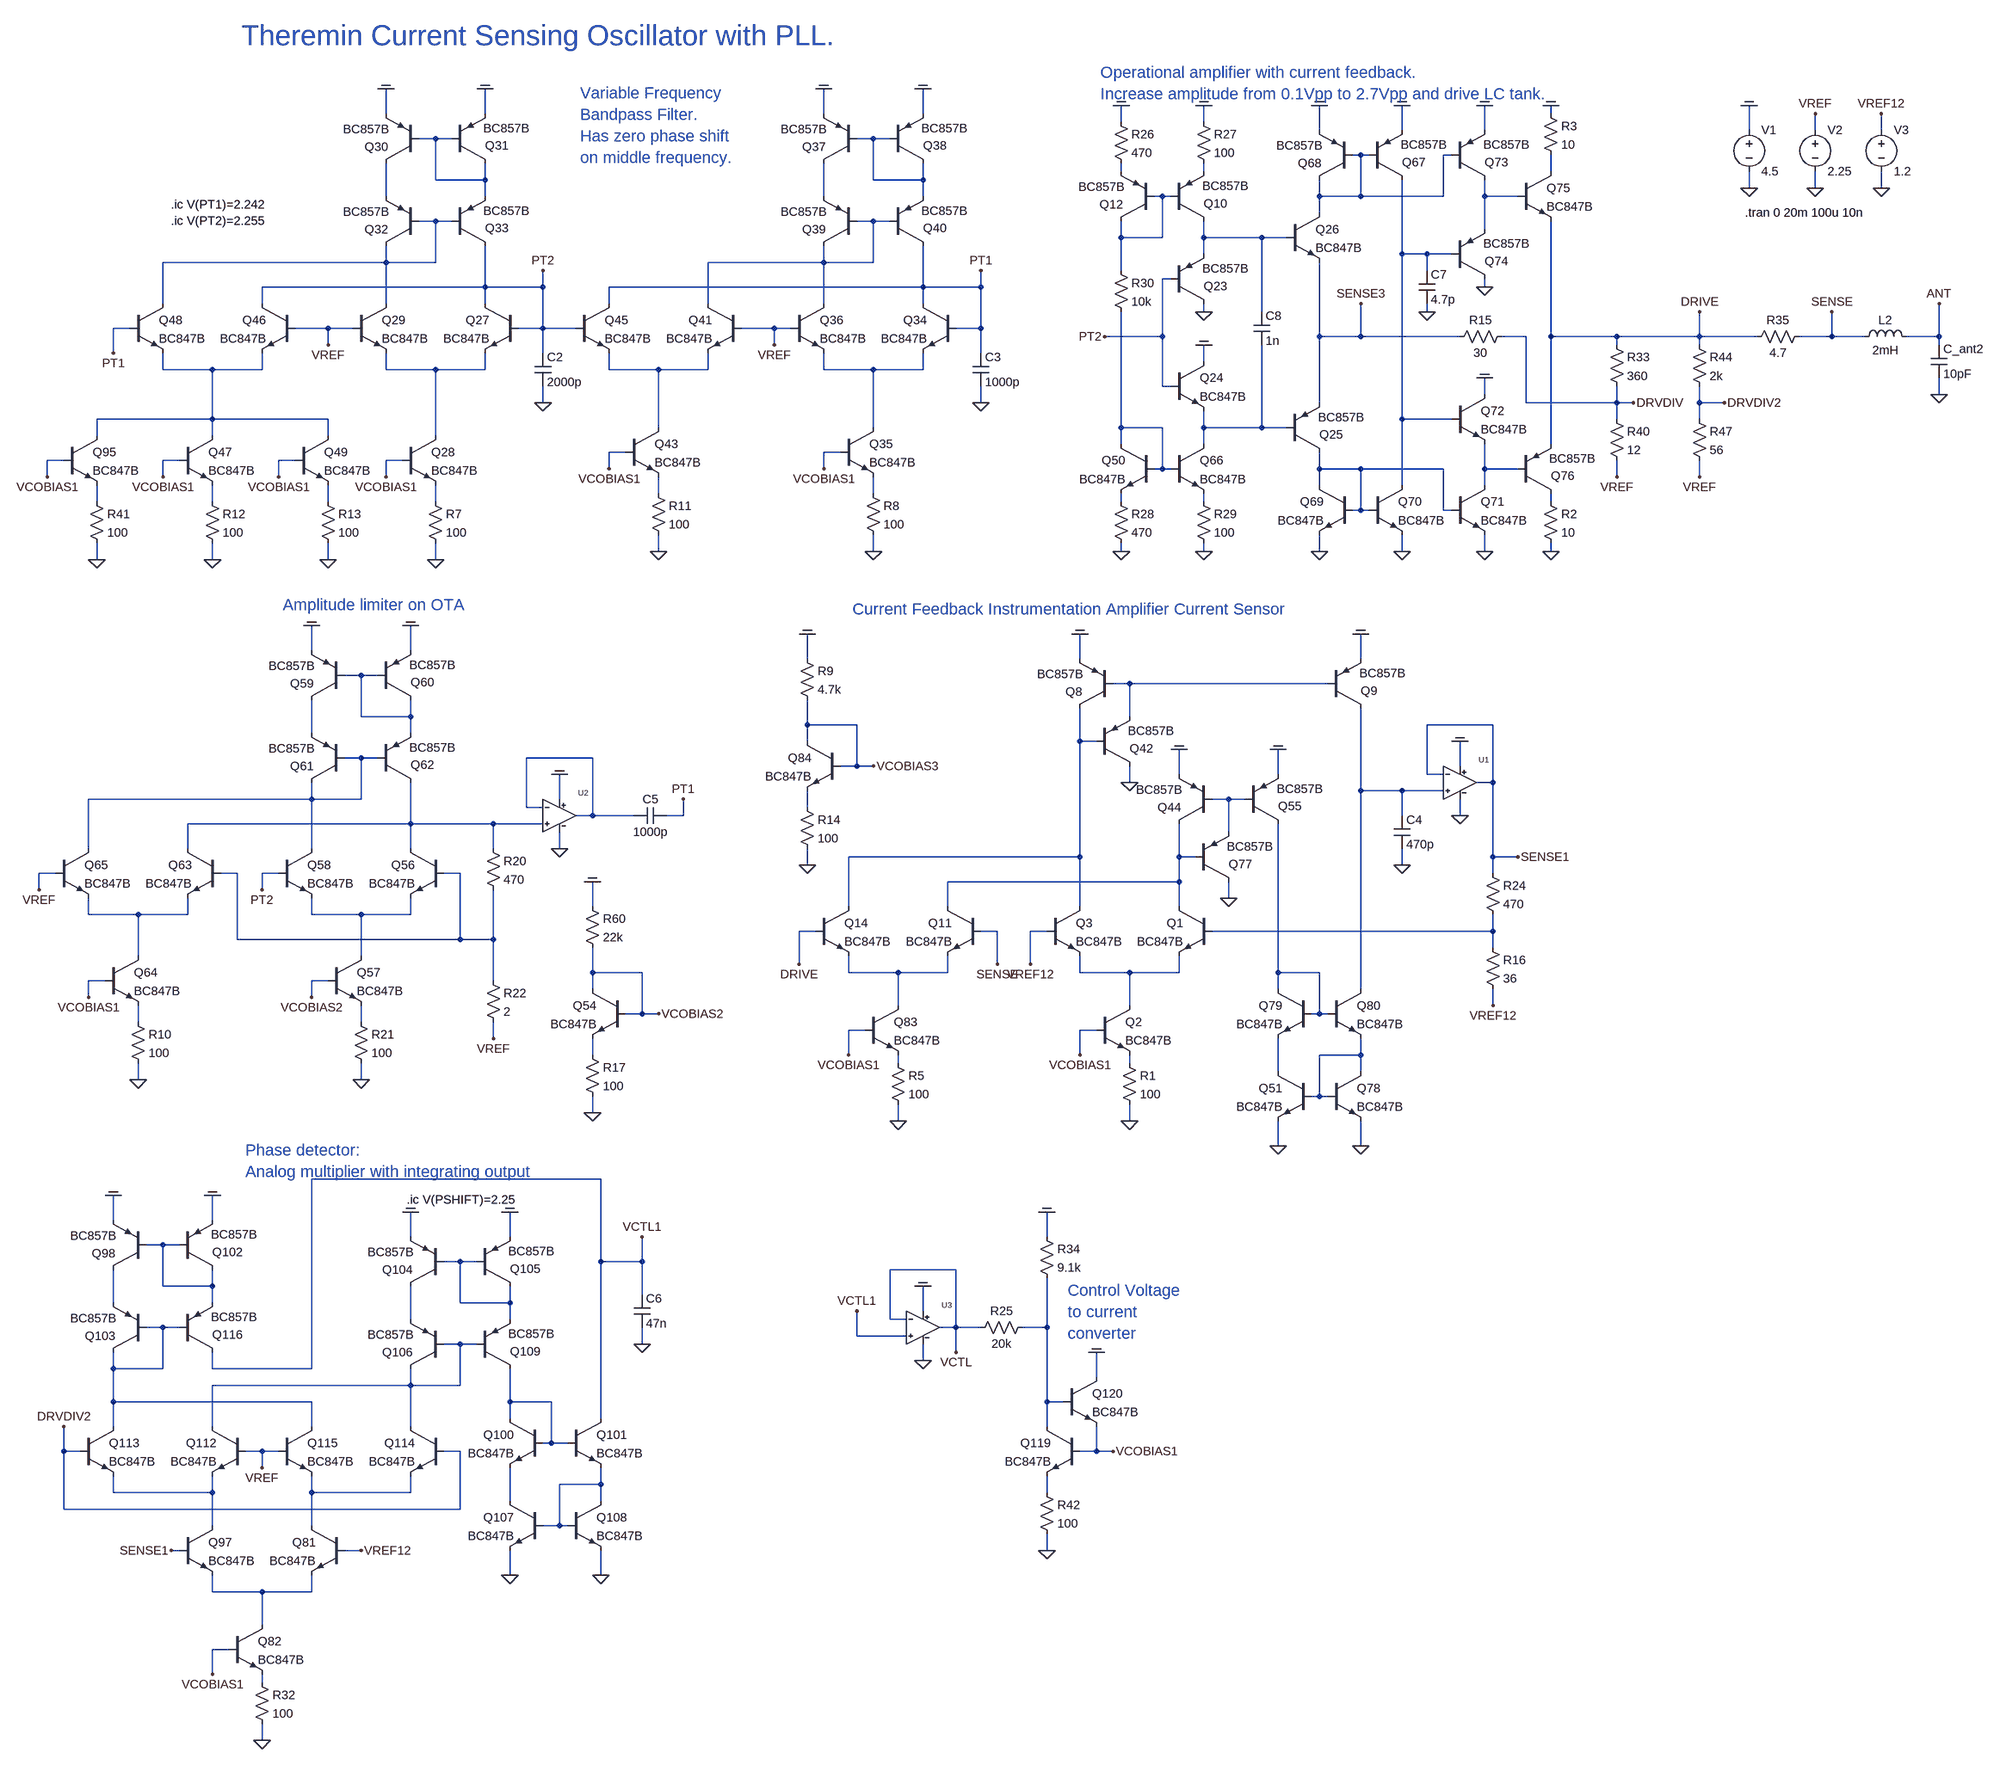
[diagram p0: schematic vco_and_lc_drive_v03.asc]
vco_and_lc_drive_v03.asc, the LTspice schematic file:
Version 4
SHEET 1 13504 21184
WIRE -5552 15856 -5552 15808
WIRE -5360 15856 -5360 15808
WIRE -4704 15856 -4704 15808
WIRE -4512 15856 -4512 15808
WIRE -3296 15856 -3296 15840
WIRE -4128 15872 -4128 15840
WIRE -3968 15872 -3968 15840
WIRE -3744 15888 -3744 15840
WIRE -3584 15888 -3584 15840
WIRE -3424 15888 -3424 15840
WIRE -2912 15888 -2912 15840
WIRE -2784 15888 -2784 15856
WIRE -2656 15888 -2656 15856
WIRE -5456 15904 -5488 15904
WIRE -5424 15904 -5456 15904
WIRE -4608 15904 -4640 15904
WIRE -4576 15904 -4608 15904
WIRE -3664 15936 -3680 15936
WIRE -3648 15936 -3664 15936
WIRE -3488 15936 -3504 15936
WIRE -4128 15968 -4128 15952
WIRE -3968 15968 -3968 15952
WIRE -3296 15968 -3296 15936
WIRE -5456 15984 -5456 15904
WIRE -5360 15984 -5360 15952
WIRE -5360 15984 -5456 15984
WIRE -4608 15984 -4608 15904
WIRE -4512 15984 -4512 15952
WIRE -4512 15984 -4608 15984
WIRE -2912 16000 -2912 15968
WIRE -2784 16000 -2784 15968
WIRE -2656 16000 -2656 15968
WIRE -5552 16016 -5552 15952
WIRE -5360 16016 -5360 15984
WIRE -4704 16016 -4704 15952
WIRE -4512 16016 -4512 15984
WIRE -4048 16016 -4064 16016
WIRE -4032 16016 -4048 16016
WIRE -3744 16016 -3744 15984
WIRE -3664 16016 -3664 15936
WIRE -3664 16016 -3744 16016
WIRE -3504 16016 -3504 15936
WIRE -3504 16016 -3664 16016
WIRE -3424 16016 -3424 15984
WIRE -3360 16016 -3424 16016
WIRE -3744 16048 -3744 16016
WIRE -5456 16064 -5488 16064
WIRE -5424 16064 -5456 16064
WIRE -4608 16064 -4640 16064
WIRE -4576 16064 -4608 16064
WIRE -3424 16080 -3424 16016
WIRE -4128 16096 -4128 16064
WIRE -4048 16096 -4048 16016
WIRE -4048 16096 -4128 16096
WIRE -3968 16096 -3968 16064
WIRE -3856 16096 -3968 16096
WIRE -3808 16096 -3856 16096
WIRE -3968 16128 -3968 16096
WIRE -3584 16128 -3584 15984
WIRE -3536 16128 -3584 16128
WIRE -3488 16128 -3536 16128
WIRE -5552 16144 -5552 16112
WIRE -5552 16144 -5984 16144
WIRE -5456 16144 -5456 16064
WIRE -5456 16144 -5552 16144
WIRE -4704 16144 -4704 16112
WIRE -4704 16144 -4928 16144
WIRE -4608 16144 -4608 16064
WIRE -4608 16144 -4704 16144
WIRE -4128 16160 -4128 16096
WIRE -3536 16160 -3536 16128
WIRE -4032 16176 -4048 16176
WIRE -5360 16192 -5360 16112
WIRE -5360 16192 -5792 16192
WIRE -5248 16192 -5248 16160
WIRE -5248 16192 -5360 16192
WIRE -4512 16192 -4512 16112
WIRE -4512 16192 -5120 16192
WIRE -4400 16192 -4400 16160
WIRE -4400 16192 -4512 16192
WIRE -3424 16192 -3424 16176
WIRE -5984 16224 -5984 16144
WIRE -5792 16224 -5792 16192
WIRE -5552 16224 -5552 16144
WIRE -5360 16224 -5360 16192
WIRE -5120 16224 -5120 16192
WIRE -4928 16224 -4928 16144
WIRE -4704 16224 -4704 16144
WIRE -4512 16224 -4512 16192
WIRE -3968 16240 -3968 16224
WIRE -3856 16240 -3856 16096
WIRE -3536 16240 -3536 16224
WIRE -6048 16272 -6080 16272
WIRE -5664 16272 -5728 16272
WIRE -5616 16272 -5664 16272
WIRE -5248 16272 -5248 16192
WIRE -5248 16272 -5296 16272
WIRE -5184 16272 -5248 16272
WIRE -4800 16272 -4864 16272
WIRE -4768 16272 -4800 16272
WIRE -4400 16272 -4400 16192
WIRE -4400 16272 -4448 16272
WIRE -4048 16288 -4048 16176
WIRE -4048 16288 -4160 16288
WIRE -3744 16288 -3744 16144
WIRE -3664 16288 -3664 16224
WIRE -3664 16288 -3744 16288
WIRE -3472 16288 -3664 16288
WIRE -3344 16288 -3392 16288
WIRE -3296 16288 -3296 16064
WIRE -3168 16288 -3296 16288
WIRE -3008 16288 -3008 16240
WIRE -3008 16288 -3168 16288
WIRE -2896 16288 -3008 16288
WIRE -2752 16288 -2752 16240
WIRE -2752 16288 -2816 16288
WIRE -2688 16288 -2752 16288
WIRE -2544 16288 -2544 16224
WIRE -2544 16288 -2608 16288
WIRE -5664 16304 -5664 16272
WIRE -4800 16304 -4800 16272
WIRE -3168 16304 -3168 16288
WIRE -3008 16304 -3008 16288
WIRE -2544 16304 -2544 16288
WIRE -6080 16320 -6080 16272
WIRE -5248 16320 -5248 16272
WIRE -4400 16320 -4400 16272
WIRE -3968 16336 -3968 16304
WIRE -5984 16352 -5984 16320
WIRE -5888 16352 -5984 16352
WIRE -5792 16352 -5792 16320
WIRE -5792 16352 -5888 16352
WIRE -5552 16352 -5552 16320
WIRE -5456 16352 -5552 16352
WIRE -5360 16352 -5360 16320
WIRE -5360 16352 -5456 16352
WIRE -5120 16352 -5120 16320
WIRE -5024 16352 -5120 16352
WIRE -4928 16352 -4928 16320
WIRE -4928 16352 -5024 16352
WIRE -4704 16352 -4704 16320
WIRE -4608 16352 -4704 16352
WIRE -4512 16352 -4512 16320
WIRE -4512 16352 -4608 16352
WIRE -4048 16384 -4048 16288
WIRE -4032 16384 -4048 16384
WIRE -3424 16400 -3424 16368
WIRE -2544 16400 -2544 16368
WIRE -5248 16416 -5248 16384
WIRE -4400 16416 -4400 16384
WIRE -3744 16416 -3744 16288
WIRE -3344 16416 -3344 16288
WIRE -3168 16416 -3168 16384
WIRE -3168 16416 -3344 16416
WIRE -3136 16416 -3168 16416
WIRE -3008 16416 -3008 16384
WIRE -2960 16416 -3008 16416
WIRE -5888 16448 -5888 16352
WIRE -5888 16448 -6112 16448
WIRE -5664 16448 -5888 16448
WIRE -3584 16448 -3584 16128
WIRE -3488 16448 -3584 16448
WIRE -3168 16448 -3168 16416
WIRE -3008 16448 -3008 16416
WIRE -5024 16464 -5024 16352
WIRE -4608 16464 -4608 16352
WIRE -4128 16464 -4128 16240
WIRE -4048 16464 -4128 16464
WIRE -3968 16464 -3968 16432
WIRE -3856 16464 -3856 16304
WIRE -3856 16464 -3968 16464
WIRE -3808 16464 -3856 16464
WIRE -6112 16480 -6112 16448
WIRE -5888 16480 -5888 16448
WIRE -5664 16480 -5664 16448
WIRE -5456 16480 -5456 16352
WIRE -4128 16496 -4128 16464
WIRE -3968 16496 -3968 16464
WIRE -3296 16496 -3296 16288
WIRE -5088 16512 -5120 16512
WIRE -4672 16512 -4704 16512
WIRE -6176 16528 -6208 16528
WIRE -5952 16528 -5984 16528
WIRE -5728 16528 -5760 16528
WIRE -5520 16528 -5552 16528
WIRE -5120 16544 -5120 16512
WIRE -4704 16544 -4704 16512
WIRE -4048 16544 -4048 16464
WIRE -4048 16544 -4064 16544
WIRE -4032 16544 -4048 16544
WIRE -3744 16544 -3744 16512
WIRE -3664 16544 -3744 16544
WIRE -3504 16544 -3664 16544
WIRE -3424 16544 -3424 16496
WIRE -3360 16544 -3424 16544
WIRE -6208 16560 -6208 16528
WIRE -5984 16560 -5984 16528
WIRE -5760 16560 -5760 16528
WIRE -5552 16560 -5552 16528
WIRE -3168 16560 -3168 16528
WIRE -3008 16560 -3008 16528
WIRE -3744 16576 -3744 16544
WIRE -3584 16576 -3584 16448
WIRE -3424 16576 -3424 16544
WIRE -5024 16592 -5024 16560
WIRE -4608 16592 -4608 16560
WIRE -6112 16608 -6112 16576
WIRE -5888 16608 -5888 16576
WIRE -5664 16608 -5664 16576
WIRE -5456 16608 -5456 16576
WIRE -4128 16608 -4128 16592
WIRE -3968 16608 -3968 16592
WIRE -3296 16608 -3296 16592
WIRE -3664 16624 -3664 16544
WIRE -3664 16624 -3680 16624
WIRE -3648 16624 -3664 16624
WIRE -3504 16624 -3504 16544
WIRE -3488 16624 -3504 16624
WIRE -5024 16704 -5024 16672
WIRE -4608 16704 -4608 16672
WIRE -4128 16704 -4128 16688
WIRE -3968 16704 -3968 16688
WIRE -3744 16704 -3744 16672
WIRE -3584 16704 -3584 16672
WIRE -3424 16704 -3424 16672
WIRE -3296 16704 -3296 16688
WIRE -6112 16720 -6112 16688
WIRE -5888 16720 -5888 16688
WIRE -5664 16720 -5664 16688
WIRE -5456 16720 -5456 16688
WIRE -5696 16896 -5696 16848
WIRE -5504 16896 -5504 16848
WIRE -4736 16912 -4736 16864
WIRE -4208 16912 -4208 16864
WIRE -3664 16912 -3664 16864
WIRE -5600 16944 -5632 16944
WIRE -5568 16944 -5600 16944
WIRE -4112 16960 -4144 16960
WIRE -3728 16960 -4112 16960
WIRE -5600 17024 -5600 16944
WIRE -5504 17024 -5504 16992
WIRE -5504 17024 -5600 17024
WIRE -4112 17024 -4112 16960
WIRE -4736 17040 -4736 16992
WIRE -4640 17040 -4736 17040
WIRE -3408 17040 -3536 17040
WIRE -5696 17056 -5696 16992
WIRE -5504 17056 -5504 17024
WIRE -4736 17072 -4736 17040
WIRE -4208 17072 -4208 17008
WIRE -4176 17072 -4208 17072
WIRE -5600 17104 -5632 17104
WIRE -5568 17104 -5600 17104
WIRE -5152 17104 -5280 17104
WIRE -4640 17120 -4640 17040
WIRE -4640 17120 -4672 17120
WIRE -4608 17120 -4640 17120
WIRE -3472 17120 -3472 17072
WIRE -4016 17136 -4016 17088
WIRE -3824 17136 -3824 17088
WIRE -3536 17136 -3536 17040
WIRE -3504 17136 -3536 17136
WIRE -4112 17152 -4112 17120
WIRE -3408 17152 -3408 17040
WIRE -3408 17152 -3440 17152
WIRE -3664 17168 -3664 17008
WIRE -3584 17168 -3664 17168
WIRE -3504 17168 -3584 17168
WIRE -5696 17184 -5696 17152
WIRE -5696 17184 -6128 17184
WIRE -5600 17184 -5600 17104
WIRE -5600 17184 -5696 17184
WIRE -5216 17184 -5216 17136
WIRE -3920 17184 -3952 17184
WIRE -3888 17184 -3920 17184
WIRE -5280 17200 -5280 17104
WIRE -5248 17200 -5280 17200
WIRE -4736 17200 -4736 17168
WIRE -5152 17216 -5152 17104
WIRE -5152 17216 -5184 17216
WIRE -5072 17216 -5152 17216
WIRE -4976 17216 -4976 17184
WIRE -4976 17216 -5008 17216
WIRE -3584 17216 -3584 17168
WIRE -3472 17216 -3472 17184
WIRE -5504 17232 -5504 17152
WIRE -5504 17232 -5936 17232
WIRE -5344 17232 -5504 17232
WIRE -5248 17232 -5344 17232
WIRE -3920 17248 -3920 17184
WIRE -6128 17280 -6128 17184
WIRE -5936 17280 -5936 17232
WIRE -5696 17280 -5696 17184
WIRE -5504 17280 -5504 17232
WIRE -5344 17280 -5344 17232
WIRE -5216 17280 -5216 17248
WIRE -4208 17296 -4208 17072
WIRE -4208 17296 -4656 17296
WIRE -4016 17296 -4016 17232
WIRE -3984 17296 -4016 17296
WIRE -3408 17296 -3408 17152
WIRE -3360 17296 -3408 17296
WIRE -4736 17312 -4736 17280
WIRE -3584 17312 -3584 17280
WIRE -6192 17328 -6224 17328
WIRE -5840 17328 -5872 17328
WIRE -5760 17328 -5792 17328
WIRE -5408 17328 -5440 17328
WIRE -3408 17328 -3408 17296
WIRE -4016 17344 -4016 17296
WIRE -4016 17344 -4464 17344
WIRE -6224 17360 -6224 17328
WIRE -5792 17360 -5792 17328
WIRE -3920 17376 -3920 17344
WIRE -5152 17392 -5152 17344
WIRE -4656 17392 -4656 17296
WIRE -4464 17392 -4464 17344
WIRE -4208 17392 -4208 17296
WIRE -4016 17392 -4016 17344
WIRE -6128 17408 -6128 17376
WIRE -6032 17408 -6128 17408
WIRE -5936 17408 -5936 17376
WIRE -5936 17408 -6032 17408
WIRE -5696 17408 -5696 17376
WIRE -5600 17408 -5696 17408
WIRE -5504 17408 -5504 17376
WIRE -5504 17408 -5600 17408
WIRE -4720 17440 -4752 17440
WIRE -4368 17440 -4400 17440
WIRE -4272 17440 -4304 17440
WIRE -3408 17440 -3408 17408
WIRE -3408 17440 -3952 17440
WIRE -5840 17456 -5840 17328
WIRE -5408 17456 -5408 17328
WIRE -5408 17456 -5840 17456
WIRE -5344 17456 -5344 17360
WIRE -5344 17456 -5408 17456
WIRE -3408 17472 -3408 17440
WIRE -6032 17488 -6032 17408
WIRE -5600 17488 -5600 17408
WIRE -4752 17504 -4752 17440
WIRE -4368 17504 -4368 17440
WIRE -4304 17504 -4304 17440
WIRE -5152 17520 -5152 17472
WIRE -5056 17520 -5152 17520
WIRE -4656 17520 -4656 17488
WIRE -4560 17520 -4656 17520
WIRE -4464 17520 -4464 17488
WIRE -4464 17520 -4560 17520
WIRE -4208 17520 -4208 17488
WIRE -4112 17520 -4208 17520
WIRE -4016 17520 -4016 17488
WIRE -4016 17520 -4112 17520
WIRE -3824 17520 -3824 17232
WIRE -3744 17520 -3824 17520
WIRE -6096 17536 -6128 17536
WIRE -5664 17536 -5696 17536
WIRE -5344 17536 -5344 17456
WIRE -5152 17552 -5152 17520
WIRE -3824 17552 -3824 17520
WIRE -3664 17552 -3664 17168
WIRE -6128 17568 -6128 17536
WIRE -5696 17568 -5696 17536
WIRE -4560 17584 -4560 17520
WIRE -4112 17584 -4112 17520
WIRE -3408 17584 -3408 17552
WIRE -5056 17600 -5056 17520
WIRE -5056 17600 -5088 17600
WIRE -5024 17600 -5056 17600
WIRE -3744 17600 -3744 17520
WIRE -3744 17600 -3760 17600
WIRE -3728 17600 -3744 17600
WIRE -6032 17616 -6032 17584
WIRE -5600 17616 -5600 17584
WIRE -4624 17632 -4656 17632
WIRE -4176 17632 -4208 17632
WIRE -5344 17648 -5344 17616
WIRE -5152 17680 -5152 17648
WIRE -4656 17680 -4656 17632
WIRE -4208 17680 -4208 17632
WIRE -3664 17680 -3664 17648
WIRE -3664 17680 -3744 17680
WIRE -4560 17696 -4560 17680
WIRE -4112 17696 -4112 17680
WIRE -3824 17712 -3824 17648
WIRE -3664 17712 -3664 17680
WIRE -6032 17728 -6032 17696
WIRE -5600 17728 -5600 17696
WIRE -3744 17760 -3744 17680
WIRE -3744 17760 -3760 17760
WIRE -3728 17760 -3744 17760
WIRE -5152 17792 -5152 17760
WIRE -4560 17808 -4560 17776
WIRE -4112 17808 -4112 17776
WIRE -3824 17856 -3824 17808
WIRE -3664 17856 -3664 17808
WIRE -5136 17920 -5696 17920
WIRE -6080 18000 -6080 17952
WIRE -5888 18000 -5888 17952
WIRE -5504 18032 -5504 17984
WIRE -5312 18032 -5312 17984
WIRE -4272 18032 -4272 17984
WIRE -5984 18048 -6016 18048
WIRE -5952 18048 -5984 18048
WIRE -5408 18080 -5440 18080
WIRE -5376 18080 -5408 18080
WIRE -5136 18080 -5136 17920
WIRE -5056 18080 -5056 18032
WIRE -5056 18080 -5136 18080
WIRE -4448 18096 -4576 18096
WIRE -5984 18128 -5984 18048
WIRE -5888 18128 -5888 18096
WIRE -5888 18128 -5984 18128
WIRE -5056 18144 -5056 18080
WIRE -6080 18160 -6080 18096
WIRE -5888 18160 -5888 18128
WIRE -5408 18160 -5408 18080
WIRE -5312 18160 -5312 18128
WIRE -5312 18160 -5408 18160
WIRE -4512 18176 -4512 18128
WIRE -5504 18192 -5504 18128
WIRE -5312 18192 -5312 18160
WIRE -4576 18192 -4576 18096
WIRE -4544 18192 -4576 18192
WIRE -5984 18208 -6016 18208
WIRE -5952 18208 -5984 18208
WIRE -4448 18208 -4448 18096
WIRE -4448 18208 -4480 18208
WIRE -4400 18208 -4448 18208
WIRE -4272 18208 -4272 18112
WIRE -4272 18208 -4320 18208
WIRE -4640 18224 -4640 18176
WIRE -4544 18224 -4640 18224
WIRE -5408 18240 -5440 18240
WIRE -5376 18240 -5408 18240
WIRE -5056 18240 -5056 18208
WIRE -4448 18256 -4448 18208
WIRE -4512 18272 -4512 18240
WIRE -6080 18288 -6080 18256
WIRE -5984 18288 -5984 18208
WIRE -5984 18288 -6080 18288
WIRE -5888 18288 -5888 18256
WIRE -5696 18288 -5696 17920
WIRE -5696 18288 -5888 18288
WIRE -4176 18304 -4176 18256
WIRE -5504 18320 -5504 18288
WIRE -5504 18320 -5888 18320
WIRE -5408 18320 -5408 18240
WIRE -5408 18320 -5504 18320
WIRE -6080 18352 -6080 18288
WIRE -5696 18352 -6080 18352
WIRE -5312 18352 -5312 18288
WIRE -5232 18352 -5312 18352
WIRE -4272 18352 -4272 18208
WIRE -4240 18352 -4272 18352
WIRE -5312 18384 -5312 18352
WIRE -5136 18384 -5136 18080
WIRE -6080 18400 -6080 18352
WIRE -5888 18400 -5888 18320
WIRE -5696 18400 -5696 18352
WIRE -5504 18400 -5504 18320
WIRE -4272 18400 -4272 18352
WIRE -5232 18432 -5232 18352
WIRE -5232 18432 -5248 18432
WIRE -5200 18432 -5232 18432
WIRE -6176 18448 -6176 18400
WIRE -6144 18448 -6176 18448
WIRE -5792 18448 -5824 18448
WIRE -5760 18448 -5792 18448
WIRE -5408 18448 -5440 18448
WIRE -4176 18448 -4176 18400
WIRE -4176 18448 -4208 18448
WIRE -4144 18448 -4176 18448
WIRE -5792 18480 -5792 18448
WIRE -5136 18512 -5136 18480
WIRE -5136 18512 -5216 18512
WIRE -6080 18528 -6080 18496
WIRE -5888 18528 -5888 18496
WIRE -5888 18528 -6080 18528
WIRE -5696 18528 -5696 18496
WIRE -5504 18528 -5504 18496
WIRE -5504 18528 -5696 18528
WIRE -4272 18528 -4272 18496
WIRE -5312 18544 -5312 18480
WIRE -5136 18544 -5136 18512
WIRE -6176 18560 -6176 18448
WIRE -5408 18560 -5408 18448
WIRE -5408 18560 -6176 18560
WIRE -5888 18592 -5888 18528
WIRE -5696 18592 -5696 18528
WIRE -5216 18592 -5216 18512
WIRE -5216 18592 -5248 18592
WIRE -5200 18592 -5216 18592
WIRE -5952 18640 -5968 18640
WIRE -5600 18640 -5632 18640
WIRE -4272 18640 -4272 18608
WIRE -5312 18688 -5312 18640
WIRE -5136 18688 -5136 18640
WIRE -5888 18720 -5888 18688
WIRE -5792 18720 -5888 18720
WIRE -5696 18720 -5696 18688
WIRE -5696 18720 -5792 18720
WIRE -5792 18784 -5792 18720
WIRE -5856 18832 -5888 18832
WIRE -5888 18880 -5888 18832
WIRE -5792 18896 -5792 18880
WIRE -5792 19008 -5792 18976
FLAG -2912 16000 0
FLAG -2912 15840 COM
FLAG -2784 16000 0
FLAG -2784 15856 VREF
FLAG -5152 17344 COM
FLAG -5024 17600 VCOBIAS2
FLAG -5152 17792 0
FLAG -5552 16560 VCOBIAS1
FLAG -5456 16720 0
FLAG -5552 15808 COM
FLAG -5360 15808 COM
FLAG -4704 16544 VCOBIAS1
FLAG -4400 16416 0
FLAG -4704 15808 COM
FLAG -4512 15808 COM
FLAG -5120 16544 VCOBIAS1
FLAG -5024 16704 0
FLAG -4800 16304 VREF
FLAG -5984 16560 VCOBIAS1
FLAG -5888 16720 0
FLAG -5664 16304 VREF
FLAG -5696 17568 VCOBIAS2
FLAG -5344 17648 VREF
FLAG -5600 17728 0
FLAG -5696 16848 COM
FLAG -5504 16848 COM
FLAG -5216 17280 0
FLAG -5216 17136 COM
FLAG -6128 17568 VCOBIAS1
FLAG -6032 17728 0
FLAG -6224 17360 VREF
FLAG -5248 16160 PT2
FLAG -4128 16704 0
FLAG -3968 16704 0
FLAG -3968 15840 COM
FLAG -4128 15840 COM
FLAG -3968 16240 0
FLAG -3968 16304 COM
FLAG -3584 15840 COM
FLAG -3744 15840 COM
FLAG -3744 16704 0
FLAG -3584 16704 0
FLAG -3536 16240 0
FLAG -3424 16704 0
FLAG -3424 16368 COM
FLAG -3424 15840 COM
FLAG -3424 16192 0
FLAG -3296 15840 COM
FLAG -3296 16704 0
FLAG -3168 16560 VREF
FLAG -2544 16400 0
FLAG -2544 16224 ANT
FLAG -2752 16240 SENSE
FLAG -3008 16240 DRIVE
FLAG -3136 16416 DRVDIV
FLAG -2656 16000 0
FLAG -2656 15856 VREF12
FLAG -4112 17808 0
FLAG -4304 17504 VREF12
FLAG -4208 16864 COM
FLAG -3664 16864 COM
FLAG -4208 17680 VCOBIAS1
FLAG -4752 17504 DRIVE
FLAG -4112 17152 0
FLAG -4016 17088 COM
FLAG -3824 17088 COM
FLAG -3920 17376 0
FLAG -4560 17808 0
FLAG -4656 17680 VCOBIAS1
FLAG -4368 17504 SENSE
FLAG -3360 17296 SENSE1
FLAG -4736 16864 COM
FLAG -4608 17120 VCOBIAS3
FLAG -4736 17312 0
FLAG -3408 17584 VREF12
FLAG -2960 16416 DRVDIV2
FLAG -4400 16160 PT1
FLAG -4976 17184 PT1
FLAG -6080 16320 PT1
FLAG -5792 17360 PT2
FLAG -5760 16560 VCOBIAS1
FLAG -5664 16720 0
FLAG -6208 16560 VCOBIAS1
FLAG -6112 16720 0
FLAG -4160 16288 PT2
FLAG -3008 16560 VREF
FLAG -3584 17312 0
FLAG -5792 19008 0
FLAG -5888 18880 VCOBIAS1
FLAG -5312 18688 0
FLAG -5136 18688 0
FLAG -5056 18032 VCTL1
FLAG -5056 18240 0
FLAG -5600 18640 VREF12
FLAG -5968 18640 SENSE1
FLAG -5792 18480 VREF
FLAG -6176 18400 DRVDIV2
FLAG -5504 17984 COM
FLAG -5312 17984 COM
FLAG -6080 17952 COM
FLAG -5888 17952 COM
FLAG -4512 18272 0
FLAG -4512 18128 COM
FLAG -3824 17856 0
FLAG -3664 17856 0
FLAG -4272 17984 COM
FLAG -4144 18448 VCOBIAS1
FLAG -4176 18256 COM
FLAG -4272 18640 0
FLAG -5248 16416 0
FLAG -4608 16704 0
FLAG -4448 18256 VCTL
FLAG -3664 16224 SENSE3
FLAG -4640 18176 VCTL1
FLAG -3472 17216 0
FLAG -3472 17072 COM
SYMBOL voltage -2912 15872 R0
SYMATTR InstName V1
SYMATTR Value 4.5
SYMBOL Voltage -2784 15872 R0
SYMATTR InstName V2
SYMATTR Value 2.25
SYMBOL Res -5168 17376 R0
SYMATTR InstName R60
SYMATTR Value 22k
SYMBOL npn -5088 17552 M0
SYMATTR InstName Q54
SYMATTR Value BC847B
SYMBOL Res -5168 17664 R0
SYMATTR InstName R17
SYMATTR Value 100
SYMBOL npn -5296 16224 M0
SYMATTR InstName Q27
SYMATTR Value BC847B
SYMBOL npn -5520 16480 R0
SYMATTR InstName Q28
SYMATTR Value BC847B
SYMBOL npn -5616 16224 R0
SYMATTR InstName Q29
SYMATTR Value BC847B
SYMBOL Res -5472 16592 R0
SYMATTR InstName R7
SYMATTR Value 100
SYMBOL pnp -5488 15952 R180
WINDOW 0 60 32 Left 2
WINDOW 3 58 66 Left 2
SYMATTR InstName Q30
SYMATTR Value BC857B
SYMBOL pnp -5424 15952 M180
WINDOW 0 64 34 Left 2
WINDOW 3 61 68 Left 2
SYMATTR InstName Q31
SYMATTR Value BC857B
SYMBOL pnp -5488 16112 R180
WINDOW 0 60 32 Left 2
WINDOW 3 58 66 Left 2
SYMATTR InstName Q32
SYMATTR Value BC857B
SYMBOL pnp -5424 16112 M180
WINDOW 0 64 34 Left 2
WINDOW 3 61 68 Left 2
SYMATTR InstName Q33
SYMATTR Value BC857B
SYMBOL npn -4448 16224 M0
SYMATTR InstName Q34
SYMATTR Value BC847B
SYMBOL npn -4672 16464 R0
SYMATTR InstName Q35
SYMATTR Value BC847B
SYMBOL npn -4768 16224 R0
SYMATTR InstName Q36
SYMATTR Value BC847B
SYMBOL Res -4624 16576 R0
SYMATTR InstName R8
SYMATTR Value 100
SYMBOL pnp -4640 15952 R180
WINDOW 0 60 32 Left 2
WINDOW 3 58 66 Left 2
SYMATTR InstName Q37
SYMATTR Value BC857B
SYMBOL pnp -4576 15952 M180
WINDOW 0 64 34 Left 2
WINDOW 3 61 68 Left 2
SYMATTR InstName Q38
SYMATTR Value BC857B
SYMBOL pnp -4640 16112 R180
WINDOW 0 60 32 Left 2
WINDOW 3 58 66 Left 2
SYMATTR InstName Q39
SYMATTR Value BC857B
SYMBOL pnp -4576 16112 M180
WINDOW 0 64 34 Left 2
WINDOW 3 61 68 Left 2
SYMATTR InstName Q40
SYMATTR Value BC857B
SYMBOL Cap -5264 16320 R0
SYMATTR InstName C2
SYMATTR Value 2000p
SYMBOL Cap -5008 17200 R90
WINDOW 0 0 32 VBottom 2
WINDOW 3 32 32 VTop 2
SYMATTR InstName C5
SYMATTR Value 1000p
SYMBOL npn -4864 16224 M0
SYMATTR InstName Q41
SYMATTR Value BC847B
SYMBOL npn -5088 16464 R0
SYMATTR InstName Q43
SYMATTR Value BC847B
SYMBOL npn -5184 16224 R0
SYMATTR InstName Q45
SYMATTR Value BC847B
SYMBOL Res -5040 16576 R0
SYMATTR InstName R11
SYMATTR Value 100
SYMBOL npn -5728 16224 M0
SYMATTR InstName Q46
SYMATTR Value BC847B
SYMBOL npn -5952 16480 R0
SYMATTR InstName Q47
SYMATTR Value BC847B
SYMBOL npn -6048 16224 R0
SYMATTR InstName Q48
SYMATTR Value BC847B
SYMBOL Res -5904 16592 R0
SYMATTR InstName R12
SYMATTR Value 100
SYMBOL npn -5440 17280 M0
SYMATTR InstName Q56
SYMATTR Value BC847B
SYMBOL npn -5664 17488 R0
SYMATTR InstName Q57
SYMATTR Value BC847B
SYMBOL npn -5760 17280 R0
SYMATTR InstName Q58
SYMATTR Value BC847B
SYMBOL Res -5360 17264 R0
SYMATTR InstName R20
SYMATTR Value 470
SYMBOL Res -5616 17600 R0
SYMATTR InstName R21
SYMATTR Value 100
SYMBOL Res -5360 17520 R0
SYMATTR InstName R22
SYMATTR Value 2
SYMBOL pnp -5632 16992 R180
WINDOW 0 60 32 Left 2
WINDOW 3 58 66 Left 2
SYMATTR InstName Q59
SYMATTR Value BC857B
SYMBOL pnp -5568 16992 M180
WINDOW 0 64 34 Left 2
WINDOW 3 61 68 Left 2
SYMATTR InstName Q60
SYMATTR Value BC857B
SYMBOL pnp -5632 17152 R180
WINDOW 0 60 32 Left 2
WINDOW 3 58 66 Left 2
SYMATTR InstName Q61
SYMATTR Value BC857B
SYMBOL pnp -5568 17152 M180
WINDOW 0 64 34 Left 2
WINDOW 3 61 68 Left 2
SYMATTR InstName Q62
SYMATTR Value BC857B
SYMBOL MCP6021 -5216 17216 R0
SYMATTR InstName U2
SYMBOL npn -5872 17280 M0
SYMATTR InstName Q63
SYMATTR Value BC847B
SYMBOL npn -6096 17488 R0
SYMATTR InstName Q64
SYMATTR Value BC847B
SYMBOL npn -6192 17280 R0
SYMATTR InstName Q65
SYMATTR Value BC847B
SYMBOL Res -6048 17600 R0
SYMATTR InstName R10
SYMATTR Value 100
SYMBOL pnp -4032 16064 M180
WINDOW 0 64 34 Left 2
WINDOW 3 61 68 Left 2
SYMATTR InstName Q10
SYMATTR Value BC857B
SYMBOL pnp -4064 16064 R180
WINDOW 0 60 32 Left 2
WINDOW 3 58 66 Left 2
SYMATTR InstName Q12
SYMATTR Value BC857B
SYMBOL pnp -4032 16224 M180
WINDOW 0 64 34 Left 2
WINDOW 3 61 68 Left 2
SYMATTR InstName Q23
SYMATTR Value BC857B
SYMBOL npn -4032 16336 R0
SYMATTR InstName Q24
SYMATTR Value BC847B
SYMBOL pnp -3808 16512 M180
WINDOW 0 64 34 Left 2
WINDOW 3 61 68 Left 2
SYMATTR InstName Q25
SYMATTR Value BC857B
SYMBOL npn -3808 16048 R0
SYMATTR InstName Q26
SYMATTR Value BC847B
SYMBOL Res -4144 15856 R0
SYMATTR InstName R26
SYMATTR Value 470
SYMBOL Res -3984 15856 R0
SYMATTR InstName R27
SYMATTR Value 100
SYMBOL Res -4144 16592 R0
SYMATTR InstName R28
SYMATTR Value 470
SYMBOL Res -3984 16592 R0
SYMATTR InstName R29
SYMATTR Value 100
SYMBOL npn -4064 16496 M0
SYMATTR InstName Q50
SYMATTR Value BC847B
SYMBOL npn -4032 16496 R0
SYMATTR InstName Q66
SYMATTR Value BC847B
SYMBOL Res -4144 16144 R0
SYMATTR InstName R30
SYMATTR Value 10k
SYMBOL pnp -3648 15984 M180
WINDOW 0 64 34 Left 2
WINDOW 3 61 68 Left 2
SYMATTR InstName Q67
SYMATTR Value BC857B
SYMBOL pnp -3680 15984 R180
WINDOW 0 60 32 Left 2
WINDOW 3 58 66 Left 2
SYMATTR InstName Q68
SYMATTR Value BC857B
SYMBOL npn -3680 16576 M0
SYMATTR InstName Q69
SYMATTR Value BC847B
SYMBOL npn -3648 16576 R0
SYMATTR InstName Q70
SYMATTR Value BC847B
SYMBOL Cap -3552 16160 R0
SYMATTR InstName C7
SYMATTR Value 4.7p
SYMBOL npn -3488 16576 R0
SYMATTR InstName Q71
SYMATTR Value BC847B
SYMBOL npn -3488 16400 R0
SYMATTR InstName Q72
SYMATTR Value BC847B
SYMBOL pnp -3488 15984 M180
WINDOW 0 64 34 Left 2
WINDOW 3 61 68 Left 2
SYMATTR InstName Q73
SYMATTR Value BC857B
SYMBOL pnp -3488 16176 M180
WINDOW 0 64 34 Left 2
WINDOW 3 61 68 Left 2
SYMATTR InstName Q74
SYMATTR Value BC857B
SYMBOL npn -3360 15968 R0
SYMATTR InstName Q75
SYMATTR Value BC847B
SYMBOL pnp -3360 16592 M180
WINDOW 0 64 34 Left 2
WINDOW 3 61 68 Left 2
SYMATTR InstName Q76
SYMATTR Value BC857B
SYMBOL Res -3184 16288 R0
SYMATTR InstName R33
SYMATTR Value 360
SYMBOL ind -2704 16304 R270
WINDOW 0 32 56 VTop 2
WINDOW 3 5 56 VBottom 2
SYMATTR InstName L2
SYMATTR Value 2mH
SYMATTR SpiceLine Rser=120 Cpar=1pF
SYMBOL Cap -2560 16304 R0
SYMATTR InstName C_ant2
SYMATTR Value 10pF
SYMBOL Res -2912 16304 R270
WINDOW 0 32 56 VTop 2
WINDOW 3 0 56 VBottom 2
SYMATTR InstName R35
SYMATTR Value 4.7
SYMBOL Cap -3872 16240 R0
SYMATTR InstName C8
SYMATTR Value 1n
SYMBOL Res -3312 16592 R0
SYMATTR InstName R2
SYMATTR Value 10
SYMBOL Res -3312 15840 R0
SYMATTR InstName R3
SYMATTR Value 10
SYMBOL Voltage -2656 15872 R0
SYMATTR InstName V3
SYMATTR Value 1.2
SYMBOL npn -3952 17392 M0
SYMATTR InstName Q1
SYMATTR Value BC847B
SYMBOL npn -4176 17584 R0
SYMATTR InstName Q2
SYMATTR Value BC847B
SYMBOL Res -4128 17680 R0
SYMATTR InstName R1
SYMATTR Value 100
SYMBOL npn -4272 17392 R0
SYMATTR InstName Q3
SYMATTR Value BC847B
SYMBOL pnp -4144 17008 R180
WINDOW 0 60 32 Left 2
WINDOW 3 58 66 Left 2
SYMATTR InstName Q8
SYMATTR Value BC857B
SYMBOL pnp -3728 17008 M180
WINDOW 0 64 34 Left 2
WINDOW 3 61 68 Left 2
SYMATTR InstName Q9
SYMATTR Value BC857B
SYMBOL npn -4400 17392 M0
SYMATTR InstName Q11
SYMATTR Value BC847B
SYMBOL npn -4720 17392 R0
SYMATTR InstName Q14
SYMATTR Value BC847B
SYMBOL pnp -4176 17120 M180
WINDOW 0 64 34 Left 2
WINDOW 3 61 68 Left 2
SYMATTR InstName Q42
SYMATTR Value BC857B
SYMBOL pnp -3952 17232 R180
WINDOW 0 60 32 Left 2
WINDOW 3 58 66 Left 2
SYMATTR InstName Q44
SYMATTR Value BC857B
SYMBOL pnp -3888 17232 M180
WINDOW 0 64 34 Left 2
WINDOW 3 61 68 Left 2
SYMATTR InstName Q55
SYMATTR Value BC857B
SYMBOL pnp -3984 17344 M180
WINDOW 0 64 34 Left 2
WINDOW 3 61 68 Left 2
SYMATTR InstName Q77
SYMATTR Value BC857B
SYMBOL npn -4624 17584 R0
SYMATTR InstName Q83
SYMATTR Value BC847B
SYMBOL Res -4576 17680 R0
SYMATTR InstName R5
SYMATTR Value 100
SYMBOL Res -4752 16896 R0
SYMATTR InstName R9
SYMATTR Value 4.7k
SYMBOL npn -4672 17072 M0
SYMATTR InstName Q84
SYMATTR Value BC847B
SYMBOL Res -4752 17184 R0
SYMATTR InstName R14
SYMATTR Value 100
SYMBOL Res -3424 17456 R0
SYMATTR InstName R16
SYMATTR Value 36
SYMBOL Res -3424 17312 R0
SYMATTR InstName R24
SYMATTR Value 470
SYMBOL Res -3184 16432 R0
SYMATTR InstName R40
SYMATTR Value 12
SYMBOL Cap -4416 16320 R0
SYMATTR InstName C3
SYMATTR Value 1000p
SYMBOL npn -5728 16480 R0
SYMATTR InstName Q49
SYMATTR Value BC847B
SYMBOL Res -5680 16592 R0
SYMATTR InstName R13
SYMATTR Value 100
SYMBOL npn -6176 16480 R0
SYMATTR InstName Q95
SYMATTR Value BC847B
SYMBOL Res -6128 16592 R0
SYMATTR InstName R41
SYMATTR Value 100
SYMBOL Res -3024 16288 R0
SYMATTR InstName R44
SYMATTR Value 2k
SYMBOL Res -3024 16432 R0
SYMATTR InstName R47
SYMATTR Value 56
SYMBOL Cap -3600 17216 R0
SYMATTR InstName C4
SYMATTR Value 470p
SYMBOL npn -5632 18592 M0
SYMATTR InstName Q81
SYMATTR Value BC847B
SYMBOL npn -5856 18784 R0
SYMATTR InstName Q82
SYMATTR Value BC847B
SYMBOL Res -5808 18880 R0
SYMATTR InstName R32
SYMATTR Value 100
SYMBOL npn -5952 18592 R0
SYMATTR InstName Q97
SYMATTR Value BC847B
SYMBOL npn -5248 18544 M0
SYMATTR InstName Q107
SYMATTR Value BC847B
SYMBOL npn -5200 18544 R0
SYMATTR InstName Q108
SYMATTR Value BC847B
SYMBOL Cap -5072 18144 R0
SYMATTR InstName C6
SYMATTR Value 47n
SYMBOL npn -5824 18400 M0
SYMATTR InstName Q112
SYMATTR Value BC847B
SYMBOL npn -6144 18400 R0
SYMATTR InstName Q113
SYMATTR Value BC847B
SYMBOL npn -5440 18400 M0
SYMATTR InstName Q114
SYMATTR Value BC847B
SYMBOL npn -5760 18400 R0
SYMATTR InstName Q115
SYMATTR Value BC847B
SYMBOL npn -5248 18384 M0
SYMATTR InstName Q100
SYMATTR Value BC847B
SYMBOL npn -5200 18384 R0
SYMATTR InstName Q101
SYMATTR Value BC847B
SYMBOL pnp -5440 18128 R180
WINDOW 0 60 32 Left 2
WINDOW 3 58 66 Left 2
SYMATTR InstName Q104
SYMATTR Value BC857B
SYMBOL pnp -5376 18128 M180
WINDOW 0 64 34 Left 2
WINDOW 3 61 68 Left 2
SYMATTR InstName Q105
SYMATTR Value BC857B
SYMBOL pnp -5440 18288 R180
WINDOW 0 60 32 Left 2
WINDOW 3 58 66 Left 2
SYMATTR InstName Q106
SYMATTR Value BC857B
SYMBOL pnp -5376 18288 M180
WINDOW 0 64 34 Left 2
WINDOW 3 61 68 Left 2
SYMATTR InstName Q109
SYMATTR Value BC857B
SYMBOL pnp -6016 18096 R180
WINDOW 0 60 32 Left 2
WINDOW 3 58 66 Left 2
SYMATTR InstName Q98
SYMATTR Value BC857B
SYMBOL pnp -5952 18096 M180
WINDOW 0 64 34 Left 2
WINDOW 3 61 68 Left 2
SYMATTR InstName Q102
SYMATTR Value BC857B
SYMBOL pnp -6016 18256 R180
WINDOW 0 60 32 Left 2
WINDOW 3 58 66 Left 2
SYMATTR InstName Q103
SYMATTR Value BC857B
SYMBOL pnp -5952 18256 M180
WINDOW 0 64 34 Left 2
WINDOW 3 61 68 Left 2
SYMATTR InstName Q116
SYMATTR Value BC857B
SYMBOL MCP6021 -4512 18208 R0
SYMATTR InstName U3
SYMBOL npn -3760 17712 M0
SYMATTR InstName Q51
SYMATTR Value BC847B
SYMBOL npn -3728 17712 R0
SYMATTR InstName Q78
SYMATTR Value BC847B
SYMBOL npn -3760 17552 M0
SYMATTR InstName Q79
SYMATTR Value BC847B
SYMBOL npn -3728 17552 R0
SYMATTR InstName Q80
SYMATTR Value BC847B
SYMBOL Res -4304 18192 R90
WINDOW 0 0 56 VBottom 2
WINDOW 3 32 56 VTop 2
SYMATTR InstName R25
SYMATTR Value 20k
SYMBOL Res -4288 18016 R0
SYMATTR InstName R34
SYMATTR Value 9.1k
SYMBOL npn -4208 18400 M0
SYMATTR InstName Q119
SYMATTR Value BC847B
SYMBOL npn -4240 18304 R0
SYMATTR InstName Q120
SYMATTR Value BC847B
SYMBOL Res -4288 18512 R0
SYMATTR InstName R42
SYMATTR Value 100
SYMBOL Res -3376 16272 R90
WINDOW 0 0 56 VBottom 2
WINDOW 3 32 56 VTop 2
SYMATTR InstName R15
SYMATTR Value 30
SYMBOL MCP6021 -3472 17152 R0
SYMATTR InstName U1
TEXT -2920 16048 Left 2 !.tran 0 20m 100u 10n
TEXT -5832 15704 Left 5 ;Theremin Current Sensing Oscillator with PLL.
TEXT -5968 16032 Left 2 !.ic V(PT1)=2.242\n.ic V(PT2)=2.255
TEXT -4168 15776 Left 3 ;Operational amplifier with current feedback.\nIncrease amplitude from 0.1Vpp to 2.7Vpp and drive LC tank.
TEXT -5752 16808 Left 3 ;Amplitude limiter on OTA
TEXT -5176 15816 Left 3 ;Variable Frequency \nBandpass Filter.\nHas zero phase shift \non middle frequency.
TEXT -4648 16816 Left 3 ;Current Feedback Instrumentation Amplifier Current Sensor
TEXT -5512 17960 Left 2 !.ic V(PSHIFT)=2.25
TEXT -5824 17864 Left 3 ;Phase detector:\nAnalog multiplier with integrating output
TEXT -4232 18136 Left 3 ;Control Voltage \nto current\nconverter

The netlist it stands for:
* vco_and_lc_drive_v03.asc
V1 COM 0 4.5
V2 VREF 0 2.25
R60 COM VCOBIAS2 22k
Q54 VCOBIAS2 VCOBIAS2 N052 0 BC847B
R17 N052 0 100
Q27 PT2 PT2 N016 0 BC847B
Q28 N016 VCOBIAS1 N028 0 BC847B
Q29 N011 VREF N016 0 BC847B
R7 N028 0 100
Q30 N007 N001 COM 0 BC857B
Q31 N001 N001 COM 0 BC857B
Q32 N011 N011 N007 0 BC857B
Q33 PT2 N011 N001 0 BC857B
Q34 PT1 PT1 N018 0 BC847B
Q35 N018 VCOBIAS1 N024 0 BC847B
Q36 N012 VREF N018 0 BC847B
R8 N024 0 100
Q37 N008 N002 COM 0 BC857B
Q38 N002 N002 COM 0 BC857B
Q39 N012 N012 N008 0 BC857B
Q40 PT1 N012 N002 0 BC857B
C2 PT2 0 2000p
C5 PT1 N037 1000p
Q41 N012 VREF N017 0 BC847B
Q43 N017 VCOBIAS1 N023 0 BC847B
Q45 PT1 PT2 N017 0 BC847B
R11 N023 0 100
Q46 PT2 VREF N015 0 BC847B
Q47 N015 VCOBIAS1 N026 0 BC847B
Q48 N011 PT1 N015 0 BC847B
R12 N026 0 100
Q56 N041 N043 N045 0 BC847B
Q57 N045 VCOBIAS2 N051 0 BC847B
Q58 N036 PT2 N045 0 BC847B
R20 N041 N043 470
R21 N051 0 100
R22 N043 VREF 2
Q59 N034 N032 COM 0 BC857B
Q60 N032 N032 COM 0 BC857B
Q61 N036 N036 N034 0 BC857B
Q62 N041 N036 N032 0 BC857B
XU2 N041 N037 COM 0 N037 MCP6021  ; pins In+ In- V+ V- OUT
Q63 N041 N043 N044 0 BC847B
Q64 N044 VCOBIAS1 N050 0 BC847B
Q65 N036 VREF N044 0 BC847B
R10 N050 0 100
Q10 N013 N009 N005 0 BC857B
Q12 N009 N009 N004 0 BC857B
Q23 0 PT2 N013 0 BC857B
Q24 COM PT2 N020 0 BC847B
Q25 N021 N020 SENSE3 0 BC857B
Q26 N003 N013 SENSE3 0 BC847B
R26 COM N004 470
R27 COM N005 100
R28 N029 0 470
R29 N030 0 100
Q50 N019 N019 N029 0 BC847B
Q66 N020 N019 N030 0 BC847B
R30 N009 N019 10k
Q67 N014 N003 COM 0 BC857B
Q68 N003 N003 COM 0 BC857B
Q69 N021 N021 0 0 BC847B
Q70 N014 N021 0 0 BC847B
C7 N014 0 4.7p
Q71 N022 N021 0 0 BC847B
Q72 COM N014 N022 0 BC847B
Q73 N010 N003 COM 0 BC857B
Q74 0 N014 N010 0 BC857B
Q75 N006 N010 DRIVE 0 BC847B
Q76 N031 N022 DRIVE 0 BC857B
R33 DRIVE DRVDIV 360
L2 SENSE ANT 2mH Rser=120 Cpar=1pF
C_ant2 ANT 0 10pF
R35 DRIVE SENSE 4.7
C8 N013 N020 1n
R2 N031 0 10
R3 COM N006 10
V3 VREF12 0 1.2
Q1 N042 N046 N048 0 BC847B
Q2 N048 VCOBIAS1 N055 0 BC847B
R1 N055 0 100
Q3 N035 VREF12 N048 0 BC847B
Q8 N035 N033 COM 0 BC857B
Q9 N038 N033 COM 0 BC857B
Q11 N042 SENSE N047 0 BC847B
Q14 N035 DRIVE N047 0 BC847B
Q42 0 N035 N033 0 BC857B
Q44 N042 N039 COM 0 BC857B
Q55 N049 N039 COM 0 BC857B
Q77 0 N042 N039 0 BC857B
Q83 N047 VCOBIAS1 N054 0 BC847B
R5 N054 0 100
R9 COM VCOBIAS3 4.7k
Q84 VCOBIAS3 VCOBIAS3 N040 0 BC847B
R14 N040 0 100
R16 N046 VREF12 36
R24 SENSE1 N046 470
R40 DRVDIV VREF 12
C3 PT1 0 1000p
Q49 N015 VCOBIAS1 N027 0 BC847B
R13 N027 0 100
Q95 N015 VCOBIAS1 N025 0 BC847B
R41 N025 0 100
R44 DRIVE DRVDIV2 2k
R47 DRVDIV2 VREF 56
C4 N038 0 470p
Q81 N067 VREF12 N070 0 BC847B
Q82 N070 VCOBIAS1 N071 0 BC847B
R32 N071 0 100
Q97 N066 SENSE1 N070 0 BC847B
Q107 N069 N065 0 0 BC847B
Q108 N065 N065 0 0 BC847B
C6 VCTL1 0 47n
Q112 N063 VREF N066 0 BC847B
Q113 N061 DRVDIV2 N066 0 BC847B
Q114 N063 DRVDIV2 N067 0 BC847B
Q115 N061 VREF N067 0 BC847B
Q100 N064 N064 N069 0 BC847B
Q101 VCTL1 N064 N065 0 BC847B
Q104 N060 N058 COM 0 BC857B
Q105 N058 N058 COM 0 BC857B
Q106 N063 N063 N060 0 BC857B
Q109 N064 N063 N058 0 BC857B
Q98 N059 N057 COM 0 BC857B
Q102 N057 N057 COM 0 BC857B
Q103 N061 N061 N059 0 BC857B
Q116 VCTL1 N061 N057 0 BC857B
XU3 VCTL1 VCTL COM 0 VCTL MCP6021  ; pins In+ In- V+ V- OUT
Q51 N056 N053 0 0 BC847B
Q78 N053 N053 0 0 BC847B
Q79 N049 N049 N056 0 BC847B
Q80 N038 N049 N053 0 BC847B
R25 N062 VCTL 20k
R34 COM N062 9.1k
Q119 N062 VCOBIAS1 N068 0 BC847B
Q120 COM N062 VCOBIAS1 0 BC847B
R42 N068 0 100
R15 DRVDIV SENSE3 30
XU1 N038 SENSE1 COM 0 SENSE1 MCP6021  ; pins In+ In- V+ V- OUT
.model NPN NPN
.model PNP PNP
.lib standard.bjt
.tran 0 20m 100u 10n
* Theremin Current Sensing Oscillator with PLL.
.ic V(PT1)=2.242
.ic V(PT2)=2.255
* Operational amplifier with current feedback.
* Increase amplitude from 0.1Vpp to 2.7Vpp and drive LC tank.
* Amplitude limiter on OTA
* Variable Frequency
* Bandpass Filter.
* Has zero phase shift
* on middle frequency.
* Current Feedback Instrumentation Amplifier Current Sensor
.ic V(PSHIFT)=2.25
* Phase detector:
* Analog multiplier with integrating output
* Control Voltage
* to current
* converter
.lib MCP6021.cir
.backanno
.end